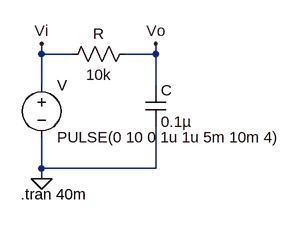
[diagram p0: schematic lab7-1.asc]
lab7-1.asc, the LTspice schematic file:
Version 4
SHEET 1 880 680
WIRE -16 80 -16 64
WIRE 32 80 -16 80
WIRE 160 80 160 64
WIRE 160 80 112 80
WIRE -16 128 -16 80
WIRE 160 128 160 80
WIRE -16 256 -16 208
WIRE 160 256 160 192
WIRE 160 256 -16 256
WIRE -16 272 -16 256
FLAG -16 272 0
FLAG 160 64 Vo
FLAG -16 64 Vi
SYMBOL voltage -16 112 R0
WINDOW 123 0 0 Left 2
WINDOW 39 0 0 Left 2
SYMATTR InstName V
SYMATTR Value PULSE(0 10 0 1u 1u 5m 10m 4)
SYMBOL res 16 96 R270
WINDOW 0 32 56 VTop 2
WINDOW 3 0 56 VBottom 2
SYMATTR InstName R
SYMATTR Value 10k
SYMBOL cap 144 128 R0
SYMATTR InstName C
SYMATTR Value 0.1µ
TEXT -48 296 Left 2 !.tran 40m

The netlist it stands for:
* lab7-1.asc
V Vi 0 PULSE(0 10 0 1u 1u 5m 10m 4)
R Vi Vo 10k
C Vo 0 0.1µ
.tran 40m
.backanno
.end

* Results of the author's LTspice run, read from the files saved beside the schematic
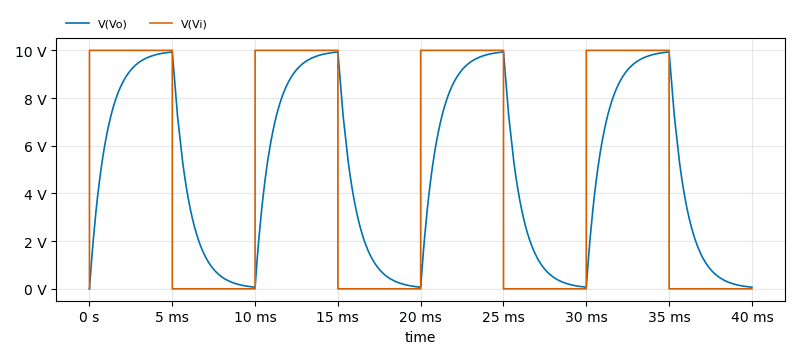
[diagram p1: Transient Analysis of lab7-1.asc, plotted from the saved traces]
* Transient Analysis, 1 run:
*   V(Vo): min 0 V, max 9.933 V, average 5.003 V, rms 6.344 V, last 66.99 mV
*   V(Vi): min 0 V, max 10 V, average 5.001 V, rms 7.072 V, last 0 V